# EAGLE design speed_controllers (EAGLE 8.6.1)
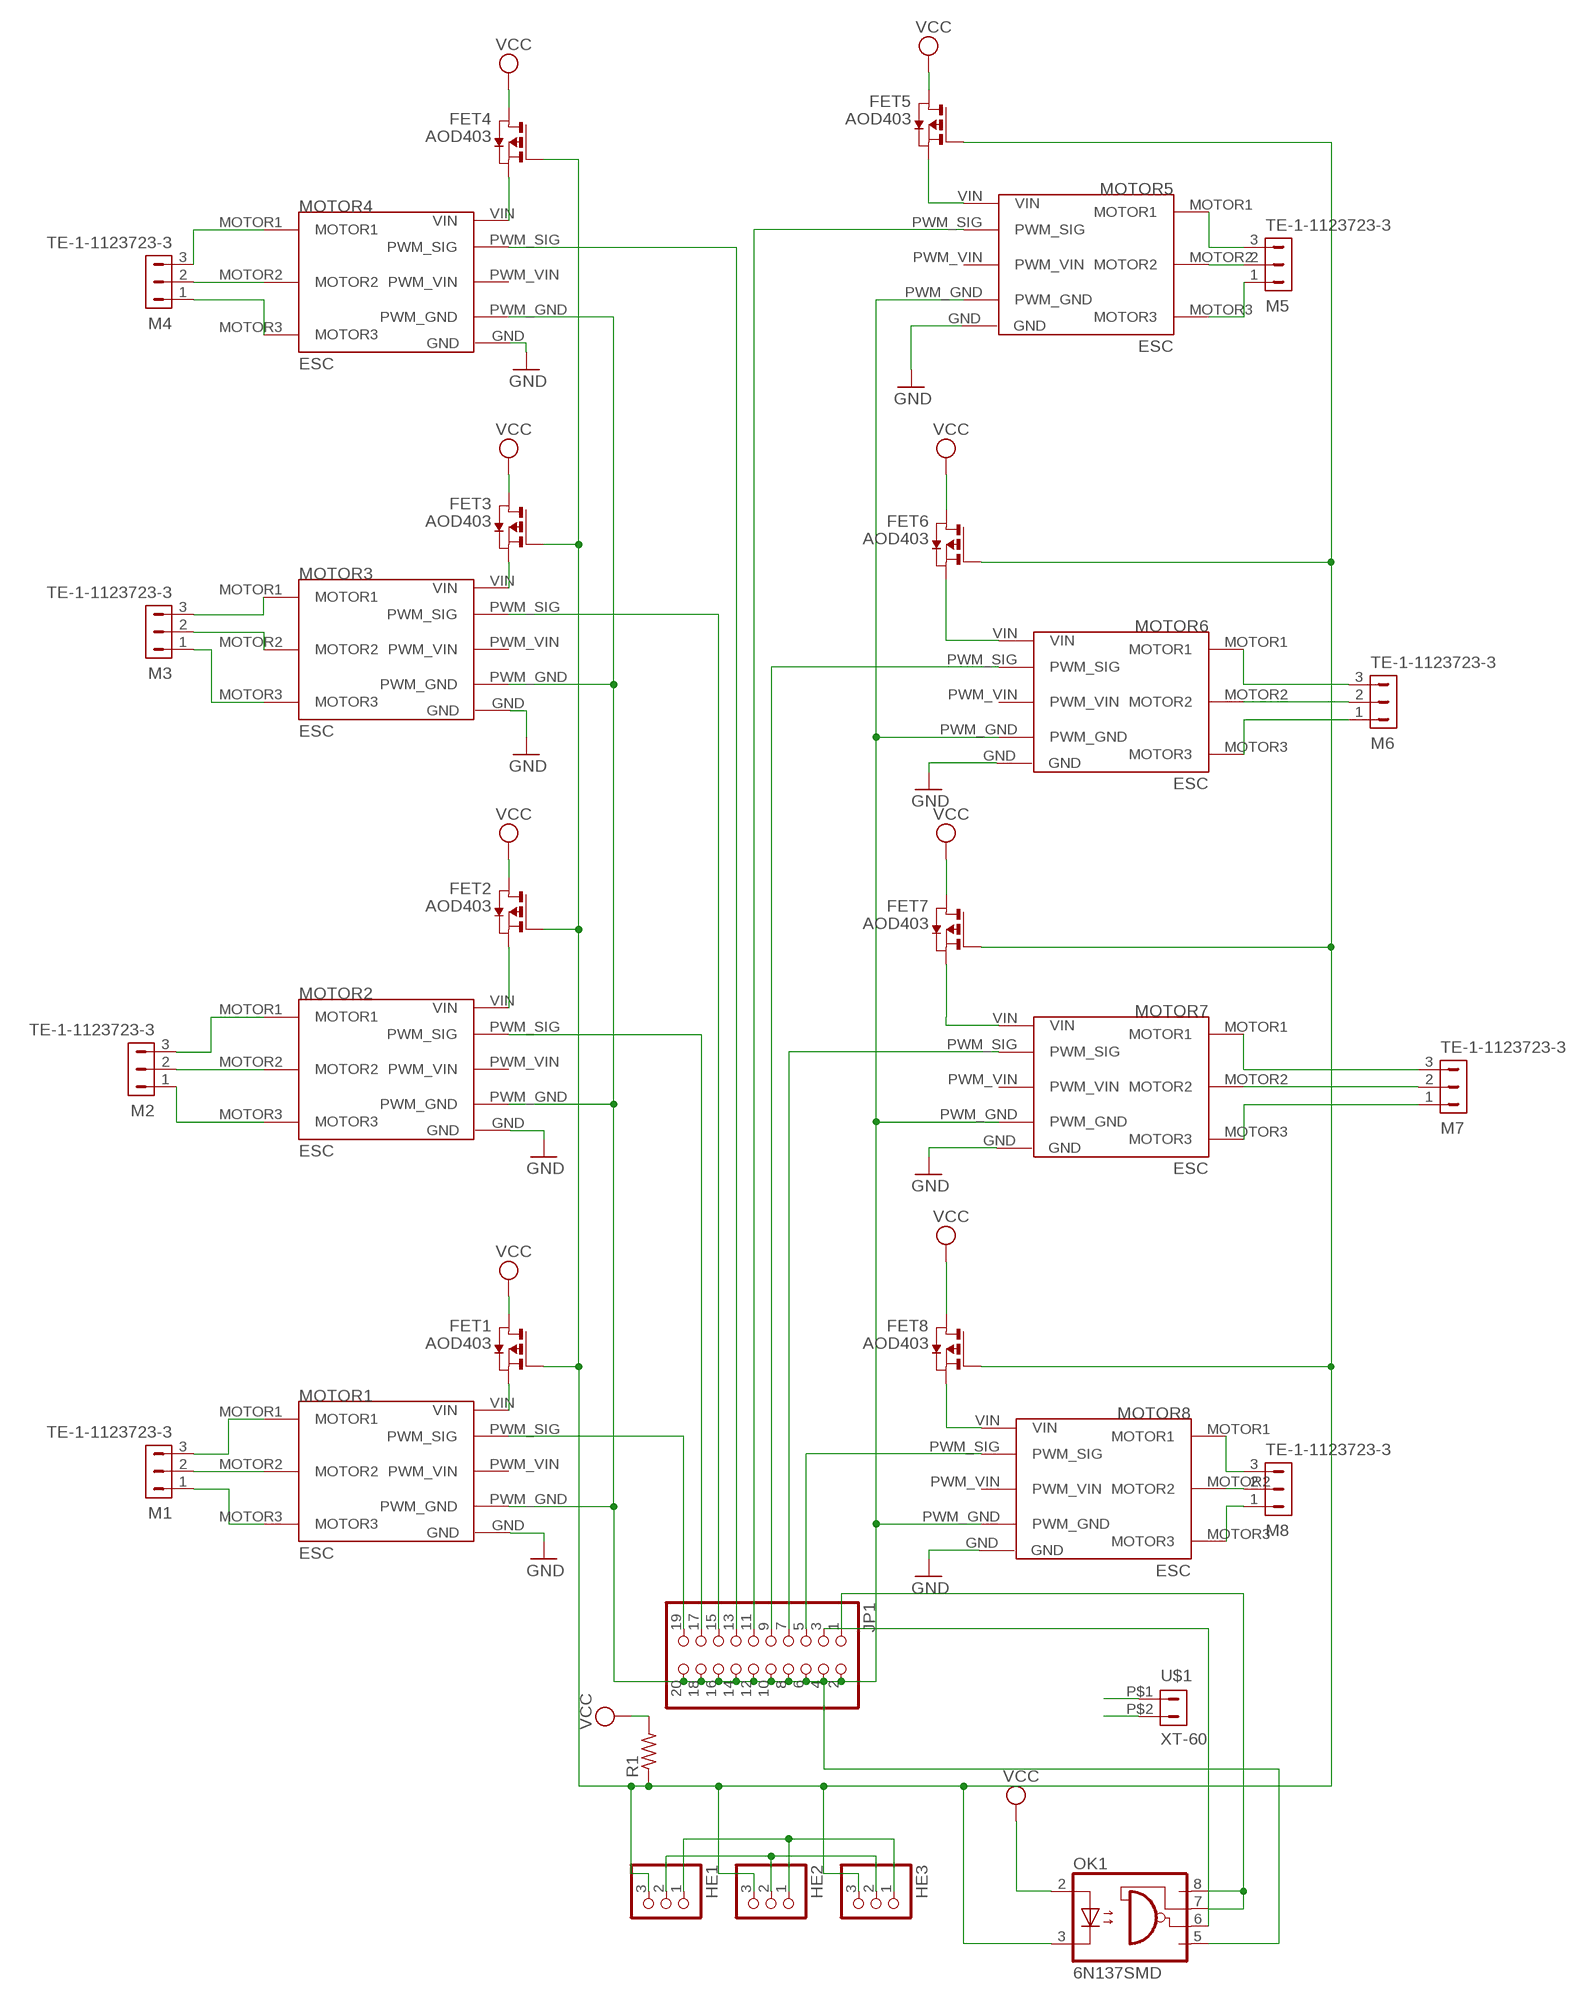
[diagram p0: schematic, sheet 1]

## Parts
FET1  AOD403  [TO252]
FET2  AOD403  [TO252]
FET3  AOD403  [TO252]
FET4  AOD403  [TO252]
FET5  AOD403  [TO252]
FET6  AOD403  [TO252]
FET7  AOD403  [TO252]
FET8  AOD403  [TO252]
HE1  PINHD-1X3  [1X03]
HE2  PINHD-1X3  [1X03]
HE3  PINHD-1X3  [1X03]
JP1  PINHD-2X10  [2X10]
M1  TE-1-1123723-3  [TE-1-1123723-3]
M2  TE-1-1123723-3  [TE-1-1123723-3]
M3  TE-1-1123723-3  [TE-1-1123723-3]
M4  TE-1-1123723-3  [TE-1-1123723-3]
M5  TE-1-1123723-3  [TE-1-1123723-3]
M6  TE-1-1123723-3  [TE-1-1123723-3]
M7  TE-1-1123723-3  [TE-1-1123723-3]
M8  TE-1-1123723-3  [TE-1-1123723-3]
MOTOR1  ESC  [ESC]
MOTOR2  ESC  [ESC]
MOTOR3  ESC  [ESC]
MOTOR4  ESC  [ESC]
MOTOR5  ESC  [ESC]
MOTOR6  ESC  [ESC]
MOTOR7  ESC  [ESC]
MOTOR8  ESC  [ESC]
OK1  6N137SMD  [DIL8-SMD]
R1  R-US_R0603  [R0603]
U$1  XT-60  [XT-60]

## Nets
FET_G: FET1.G FET2.G FET3.G FET4.G FET5.G FET6.G FET7.G FET8.G HE1.3 HE2.3 HE3.3 OK1.3(C) R1.1
GND: HE1.2 HE2.2 HE3.2 MOTOR1.GND MOTOR2.GND MOTOR3.GND MOTOR4.GND MOTOR5.GND MOTOR6.GND MOTOR7.GND MOTOR8.GND U$1.P$2
M1_1: M1.1 MOTOR1.MOTOR3
M1_2: M1.2 MOTOR1.MOTOR2
M1_3: M1.3 MOTOR1.MOTOR1
M2_1: M2.1 MOTOR2.MOTOR3
M2_2: M2.2 MOTOR2.MOTOR2
M2_3: M2.3 MOTOR2.MOTOR1
M3_1: M3.1 MOTOR3.MOTOR3
M3_2: M3.2 MOTOR3.MOTOR2
M3_3: M3.3 MOTOR3.MOTOR1
M4_1: M4.1 MOTOR4.MOTOR3
M4_2: M4.2 MOTOR4.MOTOR2
M4_3: M4.3 MOTOR4.MOTOR1
M5_1: M5.1 MOTOR5.MOTOR3
M5_2: M5.2 MOTOR5.MOTOR2
M5_3: M5.3 MOTOR5.MOTOR1
M6_1: M6.1 MOTOR6.MOTOR3
M6_2: M6.2 MOTOR6.MOTOR2
M6_3: M6.3 MOTOR6.MOTOR1
M7_1: M7.1 MOTOR7.MOTOR3
M7_2: M7.2 MOTOR7.MOTOR2
M7_3: M7.3 MOTOR7.MOTOR1
M8_1: M8.1 MOTOR8.MOTOR3
M8_2: M8.2 MOTOR8.MOTOR2
M8_3: M8.3 MOTOR8.MOTOR1
N$4: JP1.1 OK1.7(VE) OK1.8(VCC)
N$5: JP1.3 OK1.6(VO)
PWM_GND: JP1.2 JP1.4 JP1.6 JP1.8 JP1.10 JP1.12 JP1.14 JP1.16 JP1.18 JP1.20 MOTOR1.PWM_GND MOTOR2.PWM_GND MOTOR3.PWM_GND MOTOR4.PWM_GND MOTOR5.PWM_GND MOTOR6.PWM_GND MOTOR7.PWM_GND MOTOR8.PWM_GND OK1.5(GND)
SIG_1: JP1.19 MOTOR1.PWM_SIG
SIG_2: JP1.17 MOTOR2.PWM_SIG
SIG_3: JP1.15 MOTOR3.PWM_SIG
SIG_4: JP1.13 MOTOR4.PWM_SIG
SIG_5: JP1.11 MOTOR5.PWM_SIG
SIG_6: JP1.9 MOTOR6.PWM_SIG
SIG_7: JP1.7 MOTOR7.PWM_SIG
SIG_8: JP1.5 MOTOR8.PWM_SIG
VCC: FET1.D FET2.D FET3.D FET4.D FET5.D FET6.D FET7.D FET8.D HE1.1 HE2.1 HE3.1 OK1.2(A) R1.2 U$1.P$1
VIN3: FET3.S MOTOR3.VIN
VIN_1: FET1.S MOTOR1.VIN
VIN_2: FET2.S MOTOR2.VIN
VIN_4: FET4.S MOTOR4.VIN
VIN_5: FET5.S MOTOR5.VIN
VIN_6: FET6.S MOTOR6.VIN
VIN_7: FET7.S MOTOR7.VIN
VIN_8: FET8.S MOTOR8.VIN
Unconnected: MOTOR1.PWM_VIN MOTOR2.PWM_VIN MOTOR3.PWM_VIN MOTOR4.PWM_VIN MOTOR5.PWM_VIN MOTOR6.PWM_VIN MOTOR7.PWM_VIN MOTOR8.PWM_VIN

## Library data of the parts
FET1-FET8 = auv:AOD403
HE1-HE3 = auv:PINHD-1X3: PIN HEADER
JP1 = auv:PINHD-2X10: PIN HEADER
M1-M8 = auv:TE-1-1123723-3
MOTOR1-MOTOR8 = auv:ESC
OK1 = auv:6N137: MOTOROLA OPTO COUPLER
R1 = auv:R-US_: RESISTOR, American symbol
U$1 = auv:XT-60

## Board
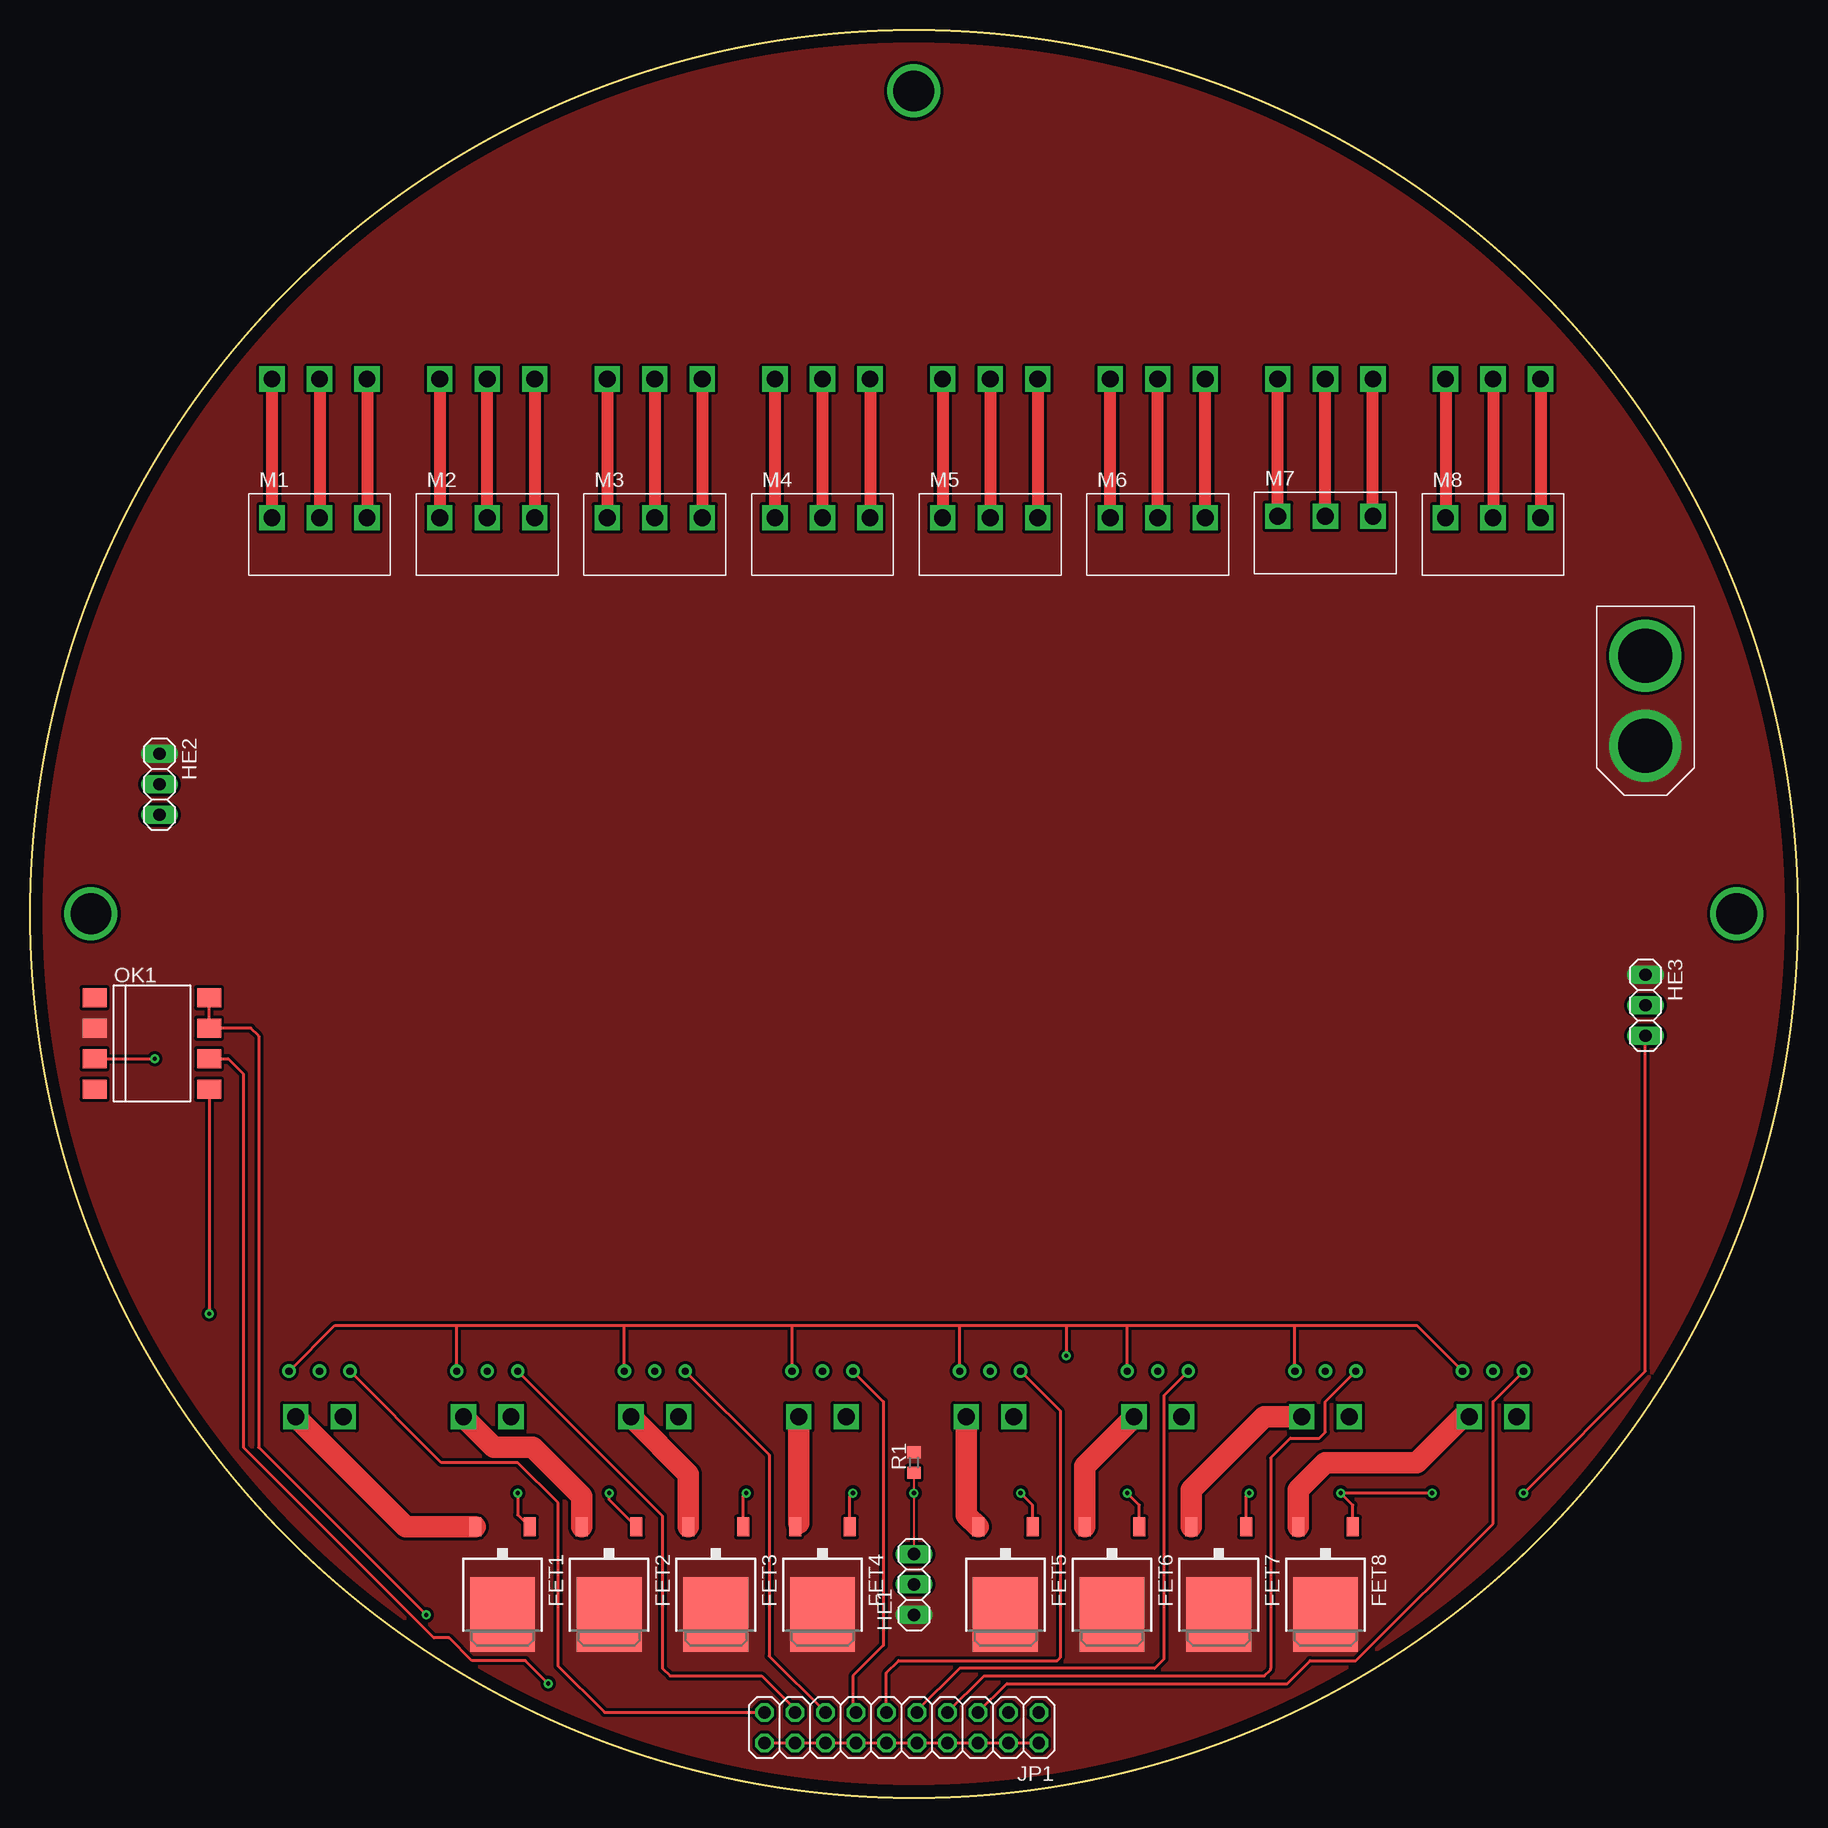
[diagram p1: board, top side]
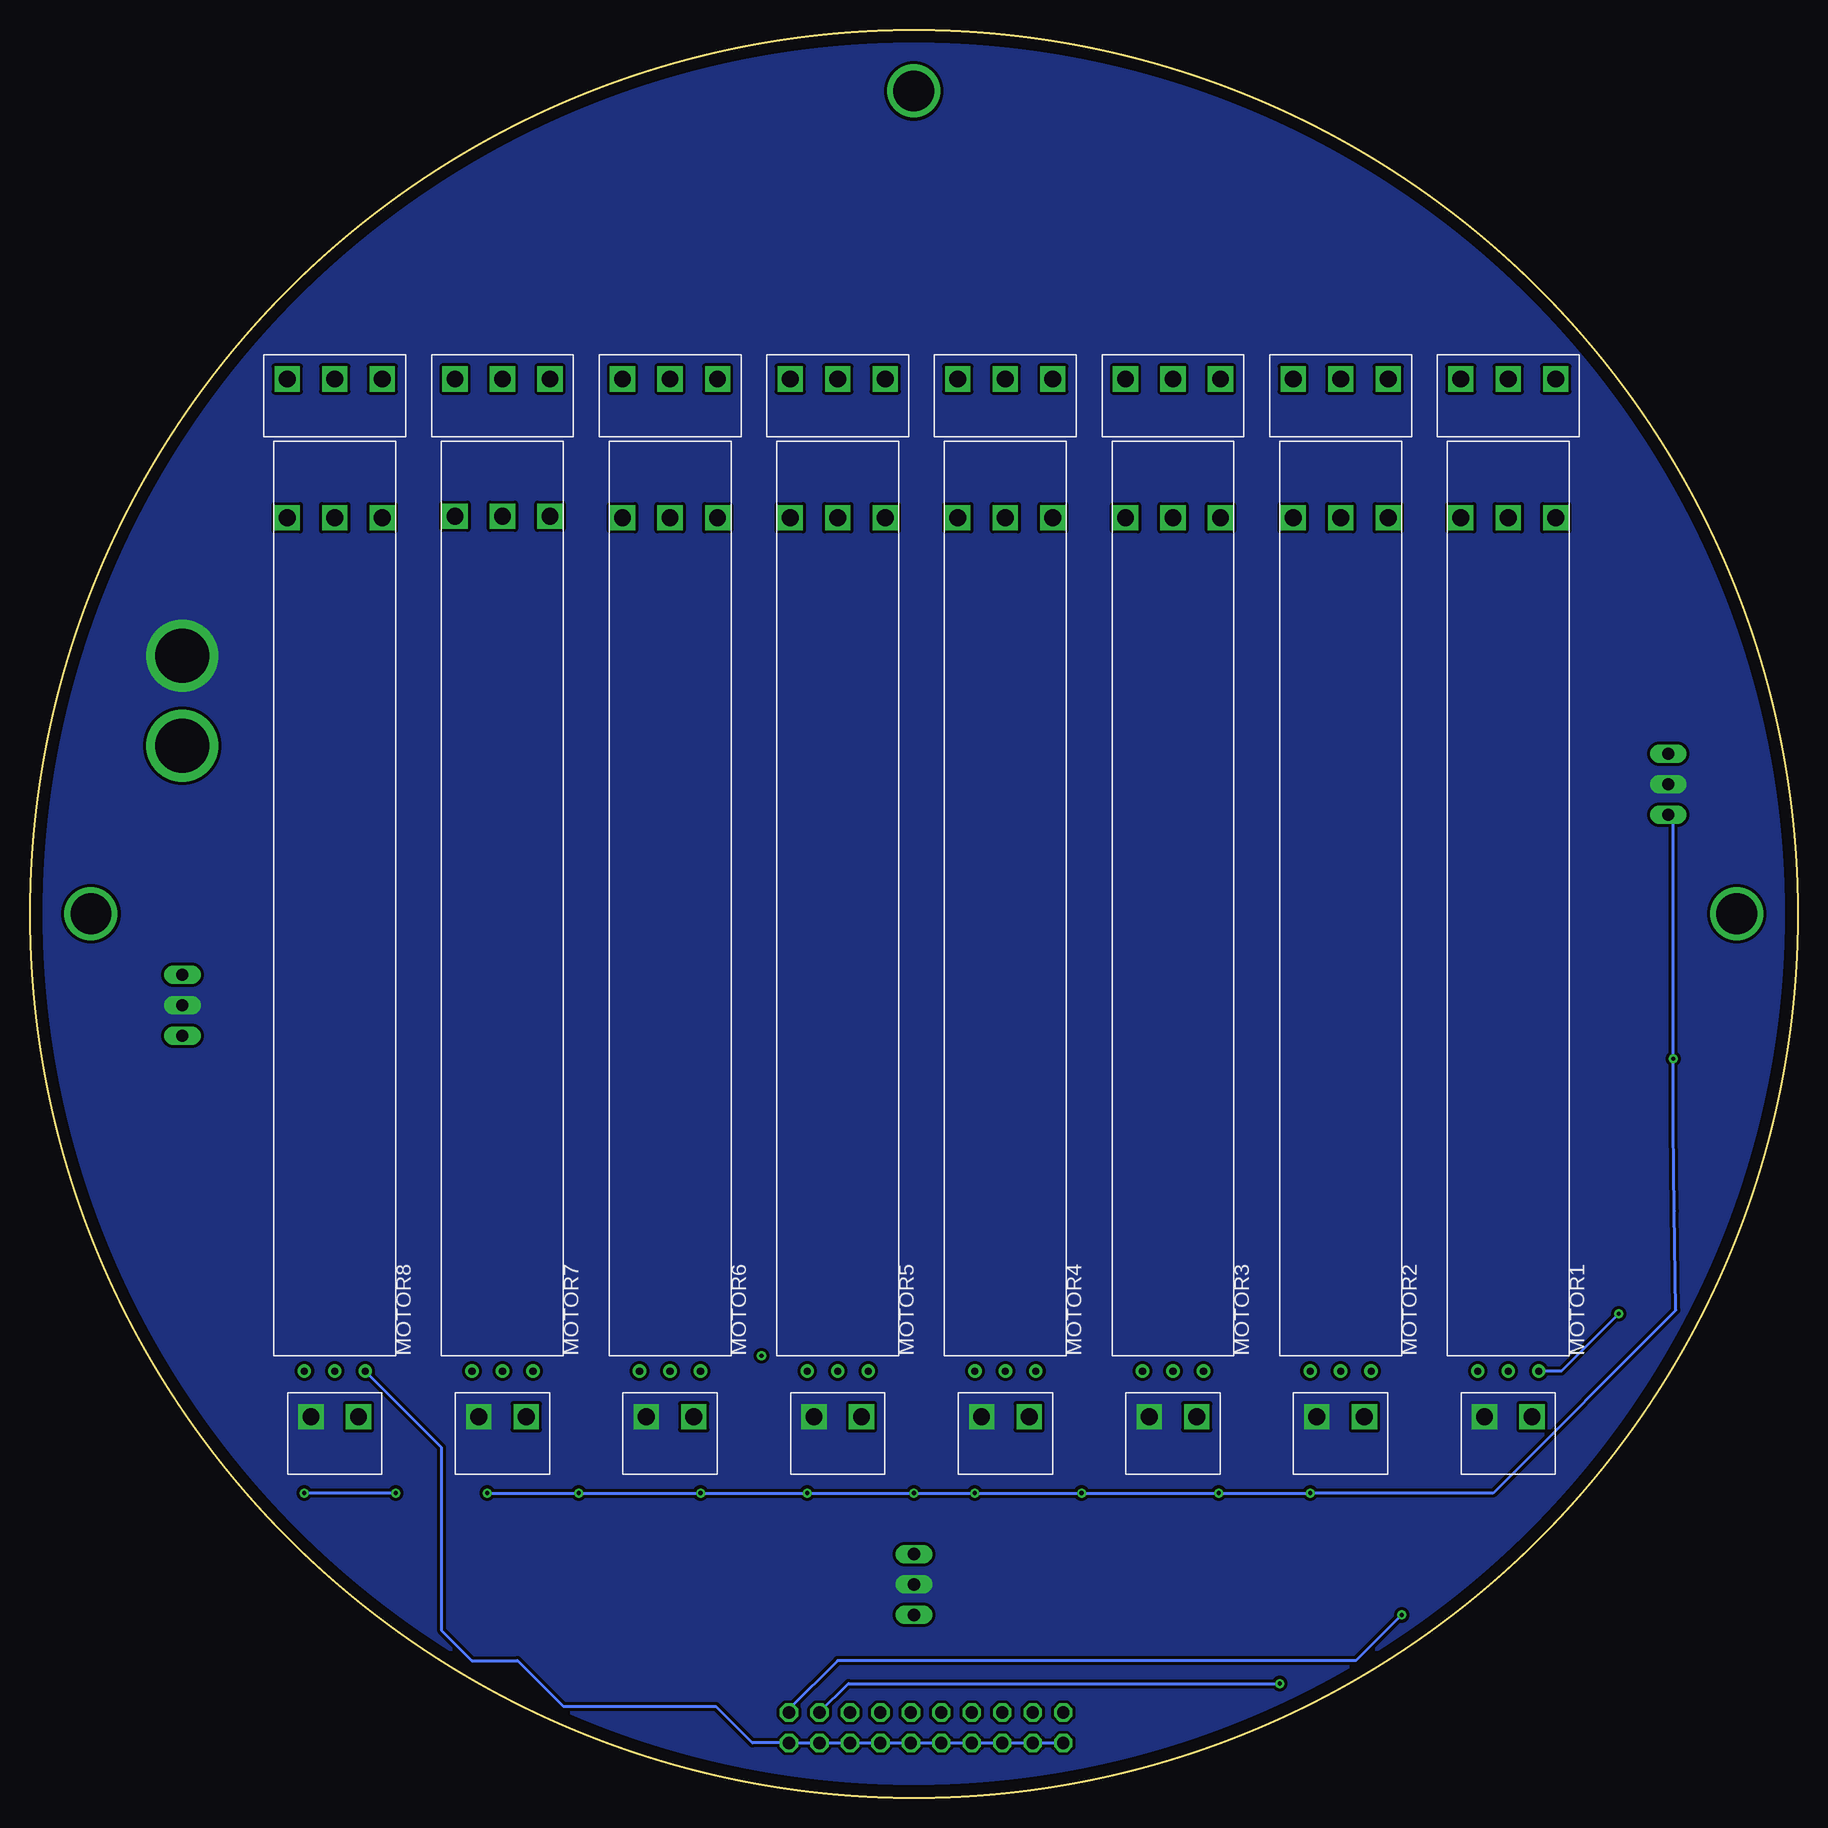
[diagram p2: board, bottom side, seen from below]

Size 147.32 x 147.32 mm. Coordinates in mm from the lower left corner, seen from the top.
Outline: circle at 73.66,73.66 radius 73.66
Copper layers (1*16): Top 0.035mm / dielectric 1.5mm / Bottom 0.035mm
Design rules "PCBway": minimum track width 6mil, minimum drill 0.3mm, track to track 0.205mm, track to pad 0.205mm, pad to pad 0.205mm, via to via 0.205mm, smd to smd 8mil, copper to edge 40mil, drill to drill 8mil, minimum pad ring 10mil, minimum via ring 8mil, stop-mask expansion 4mil, vias tented up to drill 25mil, thermal gap 10mil

### Footprints (pad centres in the part's own frame; a part is rotated, then mirrored left to right if it is on the bottom)
TO252 = smd 5.4 x 6.2: D 0,2.5 | smd 1 x 1.6: G -2.28,-4.8; S 2.28,-4.8
1X03 = drill 1.016 long: 1 -2.54,0; 2 0,0; 3 2.54,0
2X10 = drill 1.016 octagon: 1 -11.43,-1.27; 2 -11.43,1.27; 3 -8.89,-1.27; 4 -8.89,1.27; 5 -6.35,-1.27; 6 -6.35,1.27; 7 -3.81,-1.27; 8 -3.81,1.27; 9 -1.27,-1.27; 10 -1.27,1.27; 11 1.27,-1.27; 12 1.27,1.27; 13 3.81,-1.27; 14 3.81,1.27; 15 6.35,-1.27; 16 6.35,1.27; 17 8.89,-1.27; 18 8.89,1.27; 19 11.43,-1.27; 20 11.43,1.27
TE-1-1123723-3 = drill 1.4 square: 1 -3.96,0; 2 0,0; 3 3.96,0
ESC = drill 1.4 square: GND -1.98,-43.18; MOTOR1 -3.96,43.307; MOTOR2 0,43.307; MOTOR3 3.96,43.307; VIN 1.98,-43.18 | drill 0.6: PWM_GND 2.54,-39.37; PWM_SIG -2.54,-39.37; PWM_VIN 0,-39.37
DIL8-SMD = smd 1.6 x 2: 1 -3.81,-4.77; 2 -1.27,-4.77; 3 1.27,-4.77; 4 3.81,-4.77; 5 3.81,4.77; 6 1.27,4.77; 7 -1.27,4.77; 8 -3.81,4.77
R0603 = smd 1 x 1.1: 1 -0.85,0; 2 0.85,0
XT-60 = drill 4.5 pad 6: P$1 -3.75,0; P$2 3.75,0

### Placement (x,y rotation side)
FET1  39.37,17.78 180 top
FET2  48.26,17.78 180 top
FET3  57.15,17.78 180 top
FET4  66.04,17.78 180 top
FET5  81.28,17.78 180 top
FET6  90.17,17.78 180 top
FET7  99.06,17.78 180 top
FET8  107.95,17.78 180 top
HE1  73.66,17.78 90 top
HE2  10.79,84.45 270 top
HE3  134.62,66.04 270 top
JP1  72.64,5.84 180 top
M1  24.13,106.68 0 top
M2  38.1,106.68 0 top
M3  52.07,106.68 0 top
M4  66.04,106.68 0 top
M5  80.01,106.68 0 top
M6  93.98,106.68 0 top
M7  107.95,106.81 0 top
M8  121.92,106.68 0 top
MOTOR1  24.13,74.93 0 bottom
MOTOR2  38.1,74.93 0 bottom
MOTOR3  52.07,74.93 0 bottom
MOTOR4  66.04,74.93 0 bottom
MOTOR5  80.01,74.93 0 bottom
MOTOR6  93.98,74.93 0 bottom
MOTOR7  107.95,74.93 0 bottom
MOTOR8  121.92,74.93 0 bottom
OK1  10.16,62.86 270 top
R1  73.66,27.94 90 top
U$1  134.62,91.44 90 top

### Tracks (layer width: path | path; a pad name or v marks a point on that pad's centre or on a via)
FET_G  (via drill 0.35)
  Top 0.152: R1.1 v73.66,25.4 HE1.3
  Top 0.254: FET5.G 83.56,24.39 v82.55,25.4 | v40.64,25.4 40.64,23.59 FET1.G | FET2.G 48.26,24.86 v48.26,25.4 | FET3.G 59.43,25.14 v59.69,25.4 | FET7.G 101.34,25.14 v101.6,25.4 | FET6.G 92.45,24.39 v91.44,25.4 | FET4.G 68.32,25.14 v68.58,25.4 | FET8.G 110.23,24.39 v109.22,25.4 v116.84,25.4 | v124.46,25.4 134.62,35.56 HE3.3 | OK1.3 v10.39,61.59
  Bottom 0.254: v109.22,25.4 v101.6,25.4 v91.44,25.4 v82.55,25.4 v73.66,25.4 v68.58,25.4 v59.69,25.4 v48.26,25.4 v40.64,25.4 25.4,25.4 10.16,40.64 10.29,48.89 10.39,55.88 v10.39,61.59 10.39,81.51 HE2.3 | v116.84,25.4 v124.46,25.4
GND
  pour Bottom (isolate 0.254, no thermals): 149.86,149.86 -2.54,149.86 -2.54,-2.54 149.86,-2.54
M1_1
  Top 1.016: M1.1 MOTOR1.MOTOR3
M1_2
  Top 1.016: MOTOR1.MOTOR2 M1.2
M1_3
  Top 1.016: MOTOR1.MOTOR1 M1.3
M2_1
  Top 1.016: MOTOR2.MOTOR3 M2.1
M2_2
  Top 1.016: M2.2 MOTOR2.MOTOR2
M2_3
  Top 1.016: MOTOR2.MOTOR1 M2.3
M3_1
  Top 1.016: MOTOR3.MOTOR3 M3.1
M3_2
  Top 1.016: MOTOR3.MOTOR2 M3.2
M3_3
  Top 1.016: MOTOR3.MOTOR1 M3.3
M4_1
  Top 1.016: MOTOR4.MOTOR3 M4.1
M4_2
  Top 1.016: MOTOR4.MOTOR2 M4.2
M4_3
  Top 1.016: MOTOR4.MOTOR1 M4.3
M5_1
  Top 1.016: MOTOR5.MOTOR3 M5.1
M5_2
  Top 1.016: MOTOR5.MOTOR2 M5.2
M5_3
  Top 1.016: MOTOR5.MOTOR1 M5.3
M6_1
  Top 1.016: M6.1 MOTOR6.MOTOR3
M6_2
  Top 1.016: M6.2 MOTOR6.MOTOR2
M6_3
  Top 1.016: M6.3 MOTOR6.MOTOR1
M7_1
  Top 1.016: M7.1 MOTOR7.MOTOR3
M7_2
  Top 1.016: M7.2 MOTOR7.MOTOR2
M7_3
  Top 1.016: M7.3 MOTOR7.MOTOR1
M8_1
  Top 1.016: MOTOR8.MOTOR3 M8.1
M8_2
  Top 1.016: MOTOR8.MOTOR2 M8.2
M8_3
  Top 1.016: MOTOR8.MOTOR1 M8.3
N$1  (via drill 3.4)
  other vias: 142.24,73.66
N$2  (via drill 3.4)
  other vias: 73.66,142.24
N$3  (via drill 3.4)
  other vias: 5.08,73.66
N$4  (via drill 0.35)
  Top 0.254: v33.02,15.24 19.05,29.21 19.05,63.5 18.41,64.13 OK1.7 OK1.8
  Bottom 0.254: JP1.1 84.07,7.37 80.01,11.43 36.83,11.43 v33.02,15.24
N$5  (via drill 0.35)
  Top 0.254: v43.18,9.52 41.27,11.43 36.83,11.43 34.92,13.33 33.65,13.33 17.78,29.21 17.78,60.32 16.51,61.59 OK1.6
  Bottom 0.254: JP1.3 79.12,9.52 v43.18,9.52
PWM_GND  (via drill 0.35)
  Top 0.254: MOTOR1.PWM_GND 25.4,39.37 35.56,39.37 | MOTOR8.PWM_GND 115.57,39.37 105.41,39.37 | 35.56,39.37 49.53,39.37 | 49.53,39.37 63.5,39.37 | 63.5,39.37 77.47,39.37 | 77.47,39.37 86.36,39.37 | 86.36,39.37 91.44,39.37 | 91.44,39.37 105.41,39.37 | MOTOR7.PWM_GND 105.41,39.37 | MOTOR6.PWM_GND 91.44,39.37 | MOTOR5.PWM_GND 77.47,39.37 | MOTOR4.PWM_GND 63.5,39.37 | MOTOR3.PWM_GND 49.53,39.37 | MOTOR2.PWM_GND 35.56,39.37 | 86.36,39.37 v86.36,36.83 | JP1.20 JP1.18 JP1.16 JP1.14 JP1.12 JP1.10 JP1.8 JP1.6 JP1.4 JP1.2 | OK1.5 v14.93,40.33
  Bottom 0.254: MOTOR8.PWM_GND 113.03,29.21 113.03,13.97 110.49,11.43 106.68,11.43 102.87,7.62 90.17,7.62 87.12,4.57 JP1.2 JP1.20 | v14.93,40.33 19.7,35.56 MOTOR1.PWM_GND
SIG_1
  Top 0.254: MOTOR1.PWM_SIG 34.29,27.94 40.64,27.94 44.01,24.57 44.01,10.98 47.88,7.11 JP1.19
SIG_2
  Top 0.254: MOTOR2.PWM_SIG 52.7,23.49 52.7,10.79 53.34,10.16 60.96,10.16 63.75,7.37 JP1.17
SIG_3
  Top 0.254: MOTOR3.PWM_SIG 61.59,28.57 61.59,11.81 JP1.15
SIG_4
  Top 0.254: MOTOR4.PWM_SIG 71.12,33.02 71.12,12.7 68.58,10.16 68.58,7.37 JP1.13
SIG_5
  Top 0.254: MOTOR5.PWM_SIG 85.85,32.26 85.85,11.68 85.6,11.43 72.39,11.43 71.37,10.41 JP1.11
SIG_6
  Top 0.254: MOTOR6.PWM_SIG 94.49,33.53 94.49,11.56 93.73,10.79 77.47,10.79 73.91,7.24 JP1.9
SIG_7
  Top 0.254: MOTOR7.PWM_SIG 107.95,33.02 107.95,30.48 107.44,29.97 105.03,29.97 103.38,28.32 103.38,10.79 103.38,10.67 102.87,10.16 79.5,10.16 JP1.7
SIG_8
  Top 0.254: MOTOR8.PWM_SIG 121.92,33.02 121.92,22.86 110.49,11.43 106.68,11.43 104.77,9.52 81.41,9.52 JP1.5
VCC
  pour Top (isolate 0.254, no thermals): -2.54,149.86 149.86,149.86 149.86,-2.54 -2.54,-2.54
VIN3
  Top 1.778: MOTOR3.VIN 54.87,26.97 FET3.S
VIN_1
  Top 1.778: MOTOR1.VIN 31.32,22.58 FET1.S
VIN_2
  Top 0.508: 45.72,22.86 45.72,22.84 FET2.S
  Top 1.778: MOTOR2.VIN 38.66,29.21 41.91,29.21 45.98,25.14 FET2.S
VIN_4
  Top 0.508: 64.06,22.88 FET4.S
  Top 1.778: MOTOR4.VIN 64.06,22.88
VIN_5
  Top 1.778: FET5.S 78.03,23.55 MOTOR5.VIN
VIN_6
  Top 1.778: MOTOR6.VIN 87.89,27.64 FET6.S
VIN_7
  Top 0.508: 96.8,22.58 FET7.S
  Top 1.778: FET7.S 96.78,25.66 102.87,31.75 MOTOR7.VIN
VIN_8
  Top 1.778: FET8.S 105.67,25.66 107.95,27.94 115.57,27.94 119.38,31.75 MOTOR8.VIN